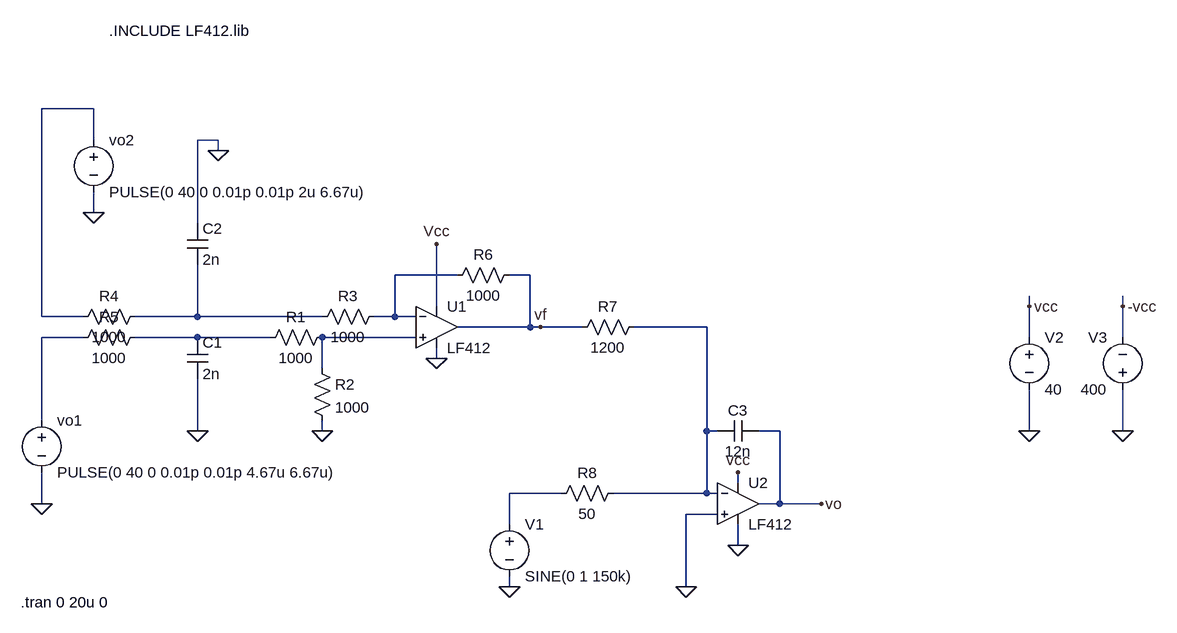
[diagram p0: schematic realimentador.asc]
realimentador.asc, the LTspice schematic file:
Version 4
SHEET 1 880 680
WIRE -1520 -144 -1600 -144
WIRE -1520 -96 -1520 -144
WIRE -1328 -96 -1360 -96
WIRE -1328 -80 -1328 -96
WIRE -1520 16 -1520 -16
WIRE -1360 32 -1360 -96
WIRE -960 112 -1056 112
WIRE -848 112 -880 112
WIRE -992 160 -992 64
WIRE -80 160 -80 144
WIRE 64 160 64 144
WIRE -1600 176 -1600 -144
WIRE -1536 176 -1600 176
WIRE -1360 176 -1360 96
WIRE -1360 176 -1456 176
WIRE -1168 176 -1360 176
WIRE -1056 176 -1056 112
WIRE -1056 176 -1088 176
WIRE -1024 176 -1056 176
WIRE -848 192 -848 112
WIRE -848 192 -960 192
WIRE -832 192 -848 192
WIRE -768 192 -832 192
WIRE -576 192 -688 192
WIRE -1536 208 -1600 208
WIRE -1360 208 -1456 208
WIRE -1248 208 -1360 208
WIRE -1024 208 -1168 208
WIRE -80 208 -80 160
WIRE 64 208 64 160
WIRE -992 240 -992 224
WIRE -1168 256 -1168 208
WIRE -1600 336 -1600 208
WIRE -1360 352 -1360 272
WIRE -1168 352 -1168 336
WIRE -576 352 -576 192
WIRE -560 352 -576 352
WIRE -464 352 -496 352
WIRE -80 352 -80 288
WIRE 64 352 64 288
WIRE -528 432 -528 416
WIRE -800 448 -880 448
WIRE -576 448 -576 352
WIRE -576 448 -720 448
WIRE -560 448 -576 448
WIRE -1600 464 -1600 416
WIRE -464 464 -464 352
WIRE -464 464 -496 464
WIRE -400 464 -464 464
WIRE -560 480 -608 480
WIRE -880 496 -880 448
WIRE -528 528 -528 496
WIRE -880 592 -880 576
WIRE -608 592 -608 480
FLAG -992 64 Vcc
FLAG -1360 352 0
FLAG -1328 -80 0
FLAG -608 592 0
FLAG -880 592 0
FLAG -400 464 vo
FLAG -1600 464 0
FLAG -1520 16 0
FLAG -832 192 vf
FLAG -80 352 0
FLAG -80 160 vcc
FLAG -528 416 vcc
FLAG 64 352 0
FLAG 64 160 -vcc
FLAG -528 528 0
FLAG -992 240 0
FLAG -1168 352 0
SYMBOL Opamps\\opamp2 -992 128 R0
SYMATTR InstName U1
SYMATTR Value LF412
SYMBOL cap -1376 208 R0
SYMATTR InstName C1
SYMATTR Value 2n
SYMBOL cap -1376 32 R0
SYMATTR InstName C2
SYMATTR Value 2n
SYMBOL res -1440 160 R90
WINDOW 0 0 56 VBottom 2
WINDOW 3 32 56 VTop 2
SYMATTR InstName R4
SYMATTR Value 1000
SYMBOL res -1440 192 R90
WINDOW 0 0 56 VBottom 2
WINDOW 3 32 56 VTop 2
SYMATTR InstName R5
SYMATTR Value 1000
SYMBOL res -1184 192 R270
WINDOW 0 32 56 VTop 2
WINDOW 3 0 56 VBottom 2
SYMATTR InstName R3
SYMATTR Value 1000
SYMBOL res -864 96 R90
WINDOW 0 0 56 VBottom 2
WINDOW 3 32 56 VTop 2
SYMATTR InstName R6
SYMATTR Value 1000
SYMBOL res -672 176 R90
WINDOW 0 0 56 VBottom 2
WINDOW 3 32 56 VTop 2
SYMATTR InstName R7
SYMATTR Value 1200
SYMBOL Opamps\\opamp2 -528 400 R0
SYMATTR InstName U2
SYMATTR Value LF412
SYMBOL res -704 432 R90
WINDOW 0 0 56 VBottom 2
WINDOW 3 32 56 VTop 2
SYMATTR InstName R8
SYMATTR Value 50
SYMBOL voltage -880 480 R0
WINDOW 123 0 0 Left 2
WINDOW 39 0 0 Left 2
SYMATTR InstName V1
SYMATTR Value SINE(0 1 150k)
SYMBOL cap -496 336 R90
WINDOW 0 0 32 VBottom 2
WINDOW 3 32 32 VTop 2
SYMATTR InstName C3
SYMATTR Value 12n
SYMBOL voltage -1600 320 R0
WINDOW 123 0 0 Left 2
WINDOW 39 0 0 Left 2
SYMATTR InstName vo1
SYMATTR Value PULSE(0 40 0 0.01p 0.01p 4.67u 6.67u)
SYMBOL voltage -1520 -112 R0
WINDOW 123 0 0 Left 2
WINDOW 39 0 0 Left 2
SYMATTR InstName vo2
SYMATTR Value PULSE(0 40 0 0.01p 0.01p 2u 6.67u)
SYMBOL voltage -80 192 R0
WINDOW 123 0 0 Left 2
WINDOW 39 0 0 Left 2
SYMATTR InstName V2
SYMATTR Value 40
SYMBOL voltage 64 304 R180
WINDOW 0 24 96 Left 2
WINDOW 3 24 16 Left 2
WINDOW 123 0 0 Left 2
WINDOW 39 0 0 Left 2
SYMATTR InstName V3
SYMATTR Value 400
SYMBOL res -1152 192 R90
WINDOW 0 0 56 VBottom 2
WINDOW 3 32 56 VTop 2
SYMATTR InstName R1
SYMATTR Value 1000
SYMBOL res -1184 240 R0
SYMATTR InstName R2
SYMATTR Value 1000
TEXT -1496 -264 Left 2 !.INCLUDE LF412.lib
TEXT -1632 616 Left 2 !.tran 0 20u 0

The netlist it stands for:
* realimentador.asc
XU1 N007 N002 Vcc 0 vf LF412  ; pins In+ In- V+ V- OUT
C1 N006 0 2n
C2 0 N003 2n
R4 N003 N001 1000
R5 N006 N005 1000
R3 N003 N002 1000
R6 vf N002 1000
R7 N004 vf 1200
XU2 0 N004 Vcc 0 vo LF412  ; pins In+ In- V+ V- OUT
R8 N004 N008 50
V1 N008 0 SINE(0 1 150k)
C3 vo N004 12n
vo1 N005 0 PULSE(0 40 0 0.01p 0.01p 4.67u 6.67u)
vo2 N001 0 PULSE(0 40 0 0.01p 0.01p 2u 6.67u)
V2 Vcc 0 40
V3 0 -vcc 400
R1 N007 N006 1000
R2 N007 0 1000
.INCLUDE LF412.lib
.tran 0 20u 0
.backanno
.end